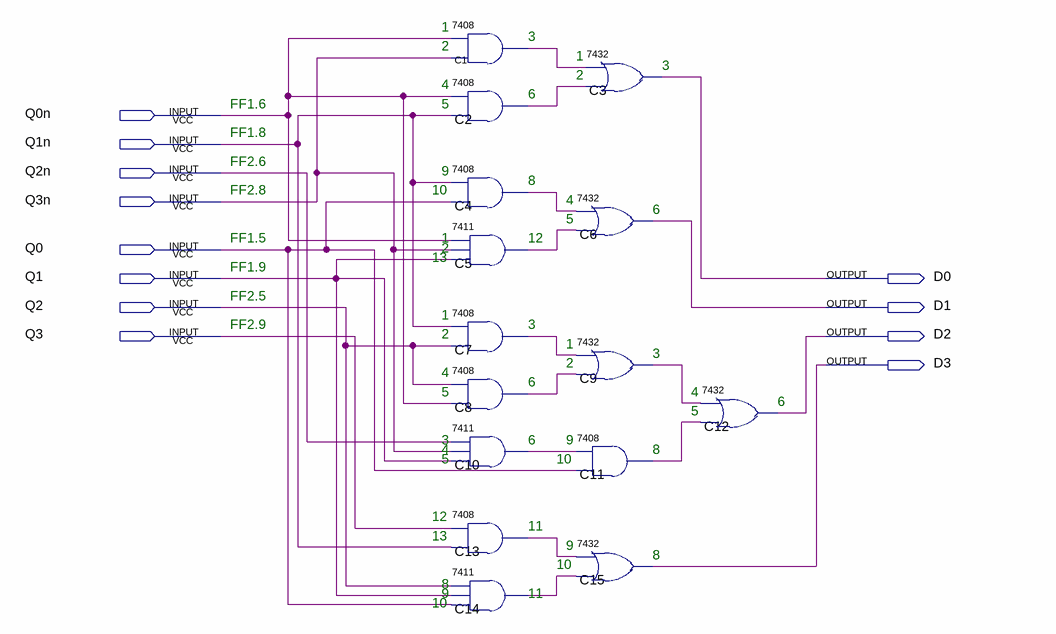
[diagram p0: schematic sheet]
// Quartus schematic uc.bdf as structural Verilog: 15 symbols, 12 pins
module uc (
  input  Q0n,
  input  Q1n,
  input  Q2n,
  input  Q3n,
  input  Q0,
  input  Q1,
  input  Q2,
  input  Q3,
  output D0,
  output D1,
  output D2,
  output D3
);

  wire C1_1, C2_1, C4_1, C5_1, C7_1, C8_1, C9_1, C10_1, C11_1, C13_1, C14_1;

  \7408  C1 (.\3 (Q3n), .\2 (Q0n), .\1 (C1_1));
  \7408  C2 (.\3 (Q1n), .\2 (Q0n), .\1 (C2_1));
  \7408  C4 (.\3 (Q0), .\2 (Q1n), .\1 (C4_1));
  \7411  C5 (.\2 (Q0n), .\3 (Q3n), .\4 (Q1), .\1 (C5_1));
  \7408  C7 (.\3 (Q2), .\2 (Q1n), .\1 (C7_1));
  \7408  C8 (.\3 (Q0n), .\2 (Q2), .\1 (C8_1));
  \7411  C10 (.\2 (Q2n), .\3 (Q3n), .\4 (Q1), .\1 (C10_1));
  \7408  C13 (.\3 (Q1n), .\2 (Q3), .\1 (C13_1));
  \7411  C14 (.\2 (Q2), .\3 (Q1), .\4 (Q0), .\1 (C14_1));
  \7432  C3 (.\2 (C1_1), .\3 (C2_1), .\1 (D0));
  \7432  C6 (.\2 (C4_1), .\3 (C5_1), .\1 (D1));
  \7432  C9 (.\2 (C7_1), .\3 (C8_1), .\1 (C9_1));
  \7408  C11 (.\3 (Q0), .\2 (C10_1), .\1 (C11_1));
  \7432  C15 (.\2 (C13_1), .\3 (C14_1), .\1 (D3));
  \7432  C12 (.\2 (C9_1), .\3 (C11_1), .\1 (D2));

  // Notes on the sheet:
  //   1
  //   3
  //   2
  //   1
  //   3
  //   2
  //   4
  //   6
  //   FF1.6
  //   5
  //   FF1.8
  //   FF2.6
  //   9
  //   8
  //   FF2.8
  //   10
  //   4
  //   6
  //   5
  //   FF1.5
  //   1
  //   12
  //   2
  //   13
  //   FF1.9
  //   FF2.5
  //   1
  //   FF2.9
  //   3
  //   2
  //   1
  //   3
  //   2
  //   4
  //   6
  //   5
  //   4
  //   6
  //   5
  //   3
  //   6
  //   9
  //   4
  //   8
  //   5
  //   10
  //   12
  //   11
  //   13
  //   9
  //   8
  //   10
  //   8
  //   9
  //   11
  //   10
endmodule
